# EAGLE design ESP_ILI9341_V3 (EAGLE 9.5.0)
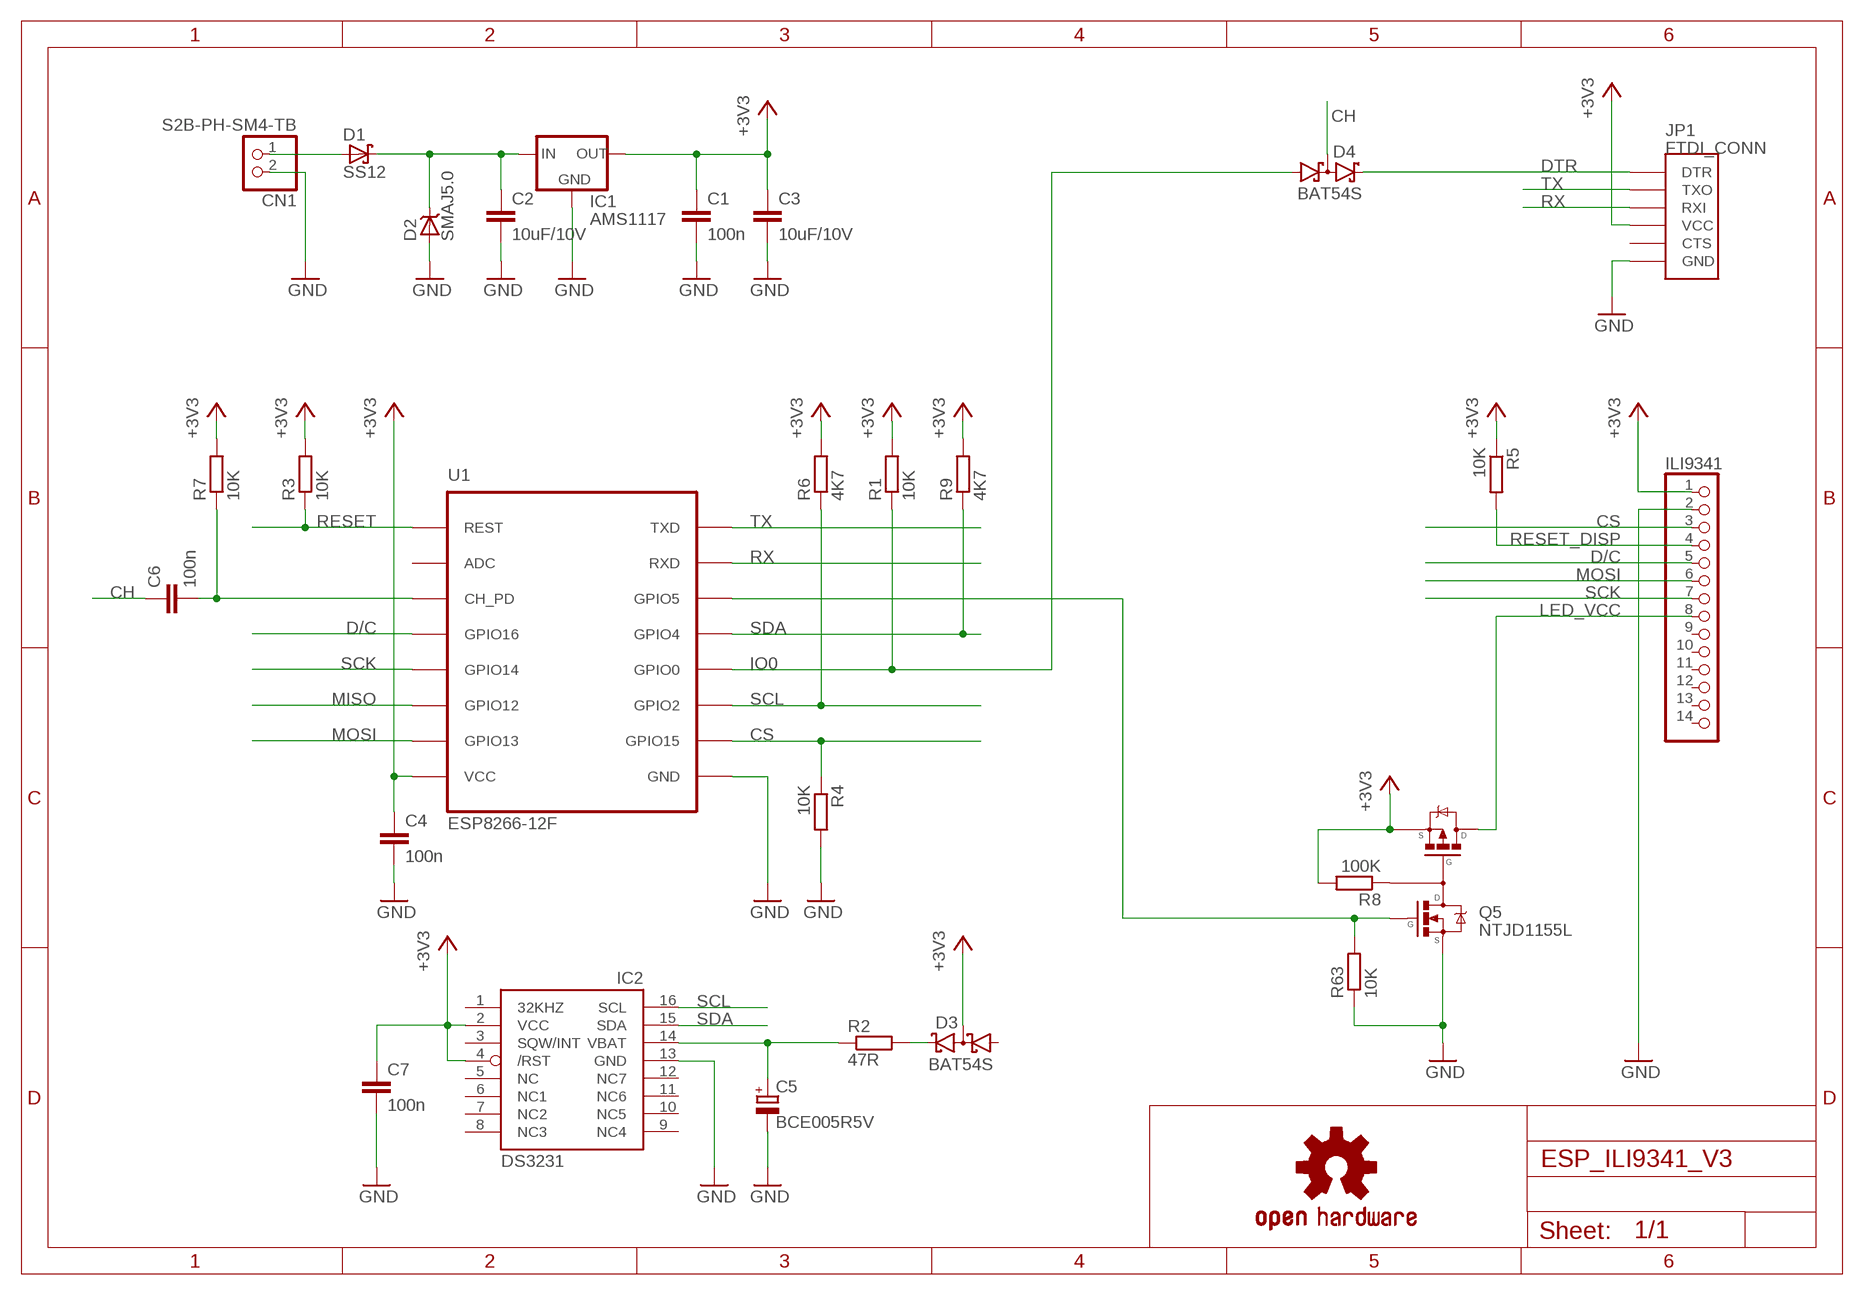
[diagram p0: schematic, sheet 1]

## Parts
C1  100n  C-EUC0805  [C0805]
C2  10uF/10V  C-EUC0805  [C0805]
C3  10uF/10V  C-EUC0805  [C0805]
C4  100n  C-EUC0805  [C0805]
C5  BCE005R5V  [BCE]
C6  100n  C-EUC0805  [C0805]
C7  100n  C-EUC0805  [C0805]
CN1  S2B-PH-SM4-TB  JST_2PIN-SMT-RA  [JST-PH-2-SMT-RA]
D1  SS12  [DO214AC]
D2  SMAJ5.0  [DO214AC]
D3  BAT54S  [SOT23]
D4  BAT54S  [SOT23]
IC1  AMS1117  LM1117-3.3  [SOT223]
IC2  DS3231/SO  [SO16W]
ILI9341  PINHD-1X14  [1X14]
JP1  FTDI_CONN  [FTDI]
LOGO1  OSHW-LOGOM-COPPER  [OSHW-LOGO-M_COPPER]
Q5  NTJD1155L  [SOT363]
R1  10K  R-EU_R0805  [R0805]
R2  47R  R-EU_R1206  [R1206]
R3  10K  R-EU_R0805  [R0805]
R4  10K  R-EU_R0805  [R0805]
R5  10K  R-EU_R0805  [R0805]
R6  4K7  R-EU_R0805  [R0805]
R7  10K  R-EU_R0805  [R0805]
R8  100K  R-EU_R0805  [R0805]
R9  4K7  R-EU_R0805  [R0805]
R63  10K  R-EU_R0805  [R0805]
U1  ESP8266-12F  ESP8266-12S  [ESP-12]

## Nets
+3V3: C1.1 C3.1 C4.1 C7.1 D3.3(C1A2) IC1.2(OUT) IC1.4(OUT) IC2.2(VCC) IC2.4(/RST) ILI9341.1 JP1.P$4(VCC) Q5.4(S2) R1.2 R3.2 R5.1 R6.2 R7.2 R8.2 R9.2 U1.VCC
CH: C6.1 D4.3(C1A2)
CS: ILI9341.3 R4.1 U1.GPIO15
D/C: ILI9341.5 U1.GPIO16
DTR: D4.2(C2) JP1.P$1(DTR)
GND: C1.2 C2.2 C3.2 C4.2 C5.- C7.2 CN1.2 D2.A IC1.1(GND) IC2.13(GND) ILI9341.2 JP1.P$6(GND) Q5.1(S1) R4.2 R63.1 U1.GND
IO0: D4.1(A1) R1.1 U1.GPIO0
LED_VCC: ILI9341.8 Q5.2(D2) Q5.3(D2)
MISO: U1.GPIO12
MOSI: ILI9341.6 U1.GPIO13
N$1: D3.2(C2) R2.2
N$2: CN1.1 D1.A
N$3: C2.1 D1.C D2.C IC1.3(IN)
N$4: C6.2 R7.1 U1.CH_PD
N$6: C5.+ IC2.14(VBAT) R2.1
N$7: Q5.6(D1/G2) R8.1
N$8: Q5.5(G1) R63.2 U1.GPIO5
RESET: R3.1 U1.REST
RESET_DISP: ILI9341.4 R5.2
RX: JP1.P$3(RXI) U1.RXD
SCK: ILI9341.7 U1.GPIO14
SCL: IC2.16(SCL) R6.1 U1.GPIO2
SDA: IC2.15(SDA) R9.1 U1.GPIO4
TX: JP1.P$2(TXO) U1.TXD
Unconnected: D3.1(A1) IC2.1(32KHZ) IC2.3(SQW/INT) IC2.5(NC) IC2.6(NC1) IC2.7(NC2) IC2.8(NC3) IC2.9(NC4) IC2.10(NC5) IC2.11(NC6) IC2.12(NC7) ILI9341.9 ILI9341.10 ILI9341.11 ILI9341.12 ILI9341.13 ILI9341.14 JP1.P$5(CTS) U1.ADC

## Library data of the parts
C1-C4 C6 C7 = rcl:C-EU: CAPACITOR, European symbol
C5 = my-super-capacitor:BCE*?: Backup super-capacitor
CN1 = adafruit:JST_2PIN: JST 2-Pin Connectors of various flavors SMT-RA (S2B-PH-SM4) 4UConnector #17311 SMT (B2B-PH-SM4) THM-RA (S2B-PH) THM (B2B-PH)
D1 = my-diode:SS?*: Schottky Barrier Rectifier; A: 1; V: 20
D2 = my-diode:SM?J*: Transient Voltage Suppression Diode - TVS
D3 D4 = diode:BAT54S: Schottky Diodes Pin connection corrected 2011-05-04 Source: Fairchild .. BAT54.pdf
IC1 = my-power:LM1117-*: LDO regulator
IC2 = adafruit:DS3231
ILI9341 = pinhead:PINHD-1X14: PIN HEADER
JP1 = my-connectors:FTDI_CONN: Connector which mates to FTDI basic or FTDI cable.
LOGO1 = SparkFun-Aesthetics:OSHW-LOGO: Open-Source Hardware (OSHW) Logo This logo indicates the piece of hardware it is found on incorporates a OSHW license and/or adheres to the definition of open source hardware found here: http://freedomdefined.org/OSHW
Q5 = my-mosfet:NTJD1155L: 8 V, 1.3 A, High Side Load Switch
R1 R3-R9 = rcl:R-EU_: RESISTOR, European symbol
R2 R63 = rcl:R-EU_: RESISTOR, European symbol; SPICEPREFIX: R
U1 = my-ESP8266:ESP8266

## Net classes
2 500mA: width 0.3 mm

## Board
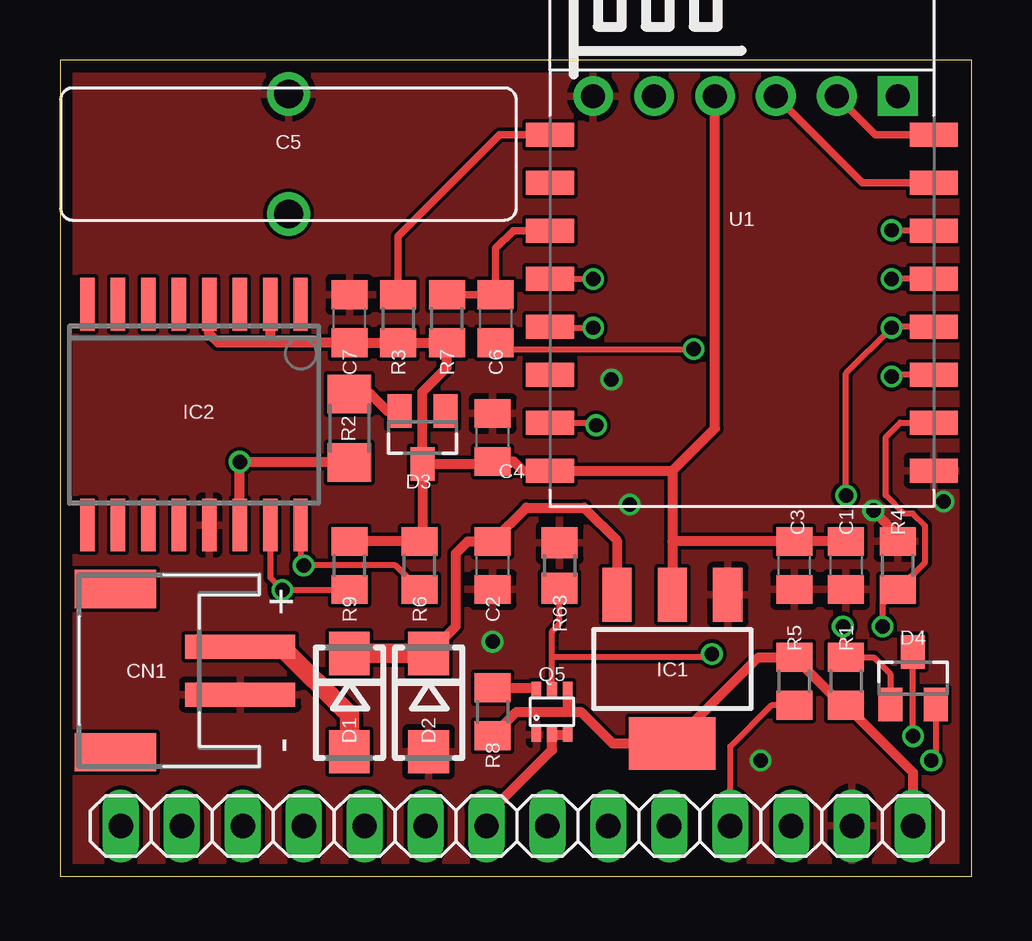
[diagram p1: board, top side]
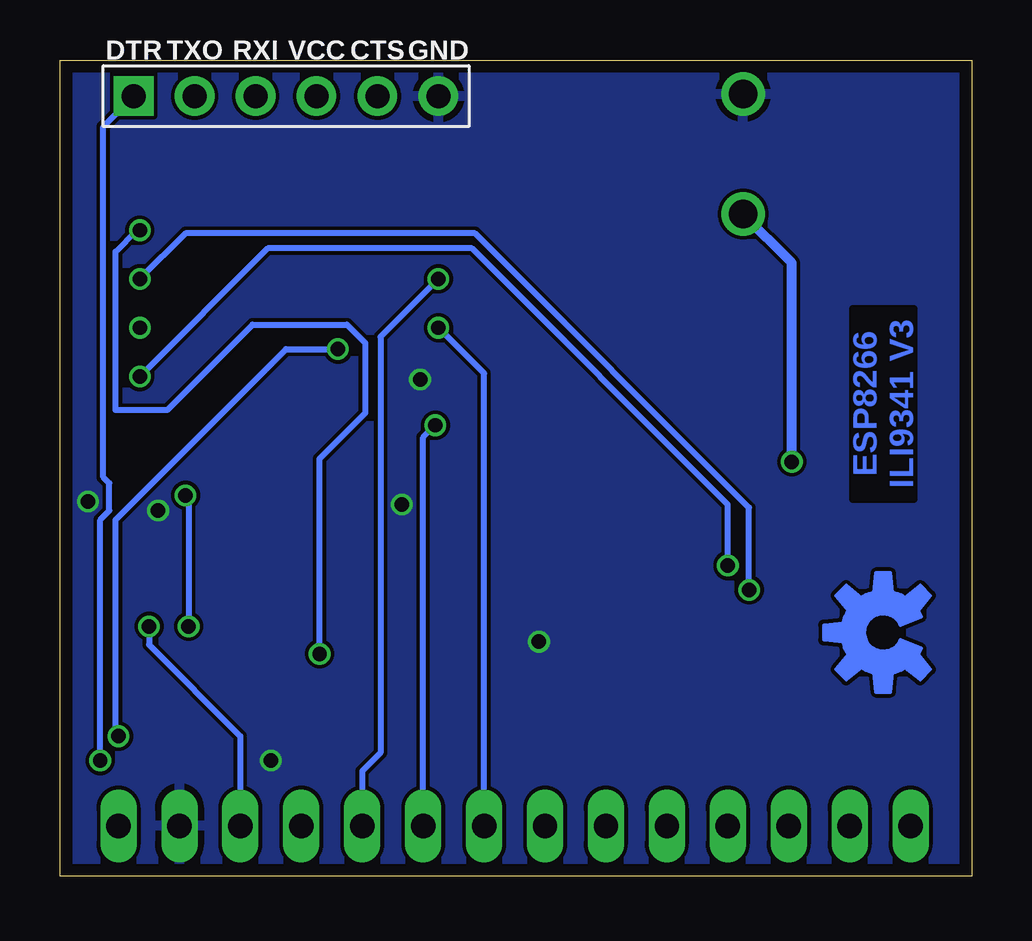
[diagram p2: board, bottom side, seen from below]

Size 38 x 34.02 mm. Coordinates in mm from the lower left corner, seen from the top.
Outline: 0,0 38,0 38,34.02 0,34.02 0,0
Copper layers (1*16): Top 0.035mm / dielectric 1.6mm / Bottom 0.035mm
Design rules "Elecrow_2-layer_PCB_eagle_rule *": minimum track width 6mil, minimum drill 12mil, track to track 6mil, track to pad 6mil, pad to pad 6mil, via to via 8mil, smd to smd 0mil, copper to edge 20mil, drill to drill 10mil, minimum pad ring 10mil, minimum via ring 6mil, stop-mask expansion 0mil, vias tented up to drill 100mil, thermal gap 10mil

### Footprints (pad centres in the part's own frame; a part is rotated, then mirrored left to right if it is on the bottom)
C0805 = smd 1.2 x 1.5: 1 -1,0; 2 1,0
BCE = drill 1.2: + -2.5,0; - 2.5,0
JST-PH-2-SMT-RA = smd 1 x 4.6: 1 1,-3.7; 2 -1,-3.7 | smd 1.6 x 3.4: NC1 -3.4,1.5; NC2 3.4,1.5
DO214AC = smd 1.8 x 1.7: A 2.05,0; C -2.05,0
SOT23 = smd 1 x 1.4: 1 -0.95,-1.1; 2 0.95,-1.1; 3 0,1.1
SOT223 = smd 1.219 x 2.235: 1 -2.311,-3.099; 2 0,-3.099; 3 2.311,-3.099 | smd 3.6 x 2.2: 4 0,3.099
SO16W = smd 0.6 x 2.2: 1 -4.445,-4.6; 2 -3.175,-4.6; 3 -1.905,-4.6; 4 -0.635,-4.6; 5 0.635,-4.6; 6 1.905,-4.6; 7 3.175,-4.6; 8 4.445,-4.6; 9 4.445,4.6; 10 3.175,4.6; 11 1.905,4.6; 12 0.635,4.6; 13 -0.635,4.6; 14 -1.905,4.6; 15 -3.175,4.6; 16 -4.445,4.6
1X14 = drill 1.016 long: 1 -16.51,0; 2 -13.97,0; 3 -11.43,0; 4 -8.89,0; 5 -6.35,0; 6 -3.81,0; 7 -1.27,0; 8 1.27,0; 9 3.81,0; 10 6.35,0; 11 8.89,0; 12 11.43,0; 13 13.97,0; 14 16.51,0
FTDI = drill 1 pad 1.651 square: P$1 -6.35,0 | drill 1 pad 1.651: P$2 -3.81,0; P$3 -1.27,0; P$4 1.27,0; P$5 3.81,0; P$6 6.35,0
SOT363 = smd 0.4 x 0.6: 1 -0.65,-0.95; 2 0,-0.95; 3 0.65,-0.95; 4 0.65,0.95; 5 0,0.95; 6 -0.65,0.95
R0805 = smd 1.2 x 1.5: 1 -1,0; 2 1,0
R1206 = smd 1.6 x 1.803: 1 -1.422,0; 2 1.422,0
R0805' = smd 1.3 x 1.5: 1 -0.95,0; 2 0.95,0
ESP-12 = smd 1 x 2: ADC -1.5,-8; CH_PD 0.5,-8; GND 10.5,8; GPIO0 4.5,8; GPIO2 6.5,8; GPIO4 2.5,8; GPIO5 0.5,8; GPIO12 6.5,-8; GPIO13 8.5,-8; GPIO14 4.5,-8; GPIO15 8.5,8; GPIO16 2.5,-8; REST -3.5,-8; RXD -1.5,8; TXD -3.5,8; VCC 10.5,-8

### Placement (x,y rotation side)
C1  32.77,12.95 270 top
C2  18.03,12.95 270 top
C3  30.61,12.95 270 top
C4  18.03,18.29 90 top
C5  9.53,30.1 90 top
C6  18.16,23.24 90 top
C7  12.06,23.24 90 top
CN1  3.81,8.57 90 top
D1  12.06,7.24 270 top
D2  15.37,7.24 270 top
D3  15.11,18.29 180 top
D4  35.56,8.26 0 top
IC1  25.53,8.64 180 top
IC2  5.59,19.24 180 top
ILI9341  19.05,2.1 180 top
JP1  28.57,32.51 0 bottom
LOGO1  3.68,10.16 90 bottom
Q5  20.51,6.86 0 top
R1  32.77,8.13 270 top
R2  12.06,18.67 90 top
R3  14.1,23.24 270 top
R4  34.92,12.95 90 top
R5  30.61,8.13 270 top
R6  14.99,12.95 90 top
R7  16.13,23.24 270 top
R8  18.03,6.86 270 top
R9  12.06,12.95 90 top
R63  10K  [R0805']  20.83,12.95 270 top
U1  28.42,27.4 270 top

### Tracks (layer width: path | path; a pad name or v marks a point on that pad's centre or on a via)
+3V3
  Top 0.406: IC2.4 6.22,22.61 6.59,22.24 8.76,22.24 | D3.3 17.93,17.19 C4.1 18.91,17.29 19.29,16.9 U1.VCC 25.53,16.9 | D3.3 15.11,20.19 16.13,21.21 R7.2 R3.2 C7.1 8.76,22.24 | IC2.2 8.76,22.24 | R9.2 R6.2 15.11,14.08 D3.3 | C1.1 C3.1 25.53,13.95 | 25.53,13.95 IC1.2 | ILI9341.1 35.56,4.33 R1.2 32.61,7.13 R5.1 29.12,9.13 IC1.4 23.04,5.54 21.72,6.86 21.16,6.86 | R8.2 19.03,6.86 21.16,6.86 | Q5.4 21.16,6.86 | 25.53,16.9 25.53,13.95 | 25.53,16.9 27.3,18.68 JP1.P$4
CH  (via drill 0.6)
  Top 0.254: C6.1 18.43,21.97 v26.42,21.97 | v35.56,5.84 D4.3
  Bottom 0.254: v26.42,21.97 28.57,21.97 35.69,14.86 35.69,5.97 v35.56,5.84
CS  (via drill 0.6)
  Top 0.254: v34.29,10.41 34.29,11.32 R4.1 36.07,13.1 36.07,14.61 35.56,15.11 35.18,15.11 34.42,15.88 34.42,18.29 35.03,18.9 U1.GPIO15
  Bottom 0.254: v34.29,10.41 34.29,9.65 30.48,5.84 ILI9341.3
D/C  (via drill 0.6)
  Top 0.254: U1.GPIO16 22.21,24.9 v22.23,24.89
  Bottom 0.254: v22.23,24.89 24.64,22.48 24.64,5.15 25.4,4.39 ILI9341.5
DTR  (via drill 0.6)
  Top 0.254: D4.2 36.51,5.01 v36.32,4.83
  Bottom 0.254: v36.32,4.83 36.32,14.86 35.94,15.24 35.94,16.38 36.2,16.64 36.2,31.24 JP1.P$1
GND  (via drill 0.6)
  Top 0.406: R4.2 34.92,14.22 v33.91,15.24
  other vias: 36.83,15.62 29.21,4.83 23.75,15.49 22.99,20.7 18.03,9.78
  pour Top: 0,0 38.1,0 38.1,34.04 0,34.04
  pour Bottom: 0,34.04 0,0 38.1,0 38.1,34.04
IO0  (via drill 0.6)
  Top 0.254: D4.1 34.61,8.44 33.92,9.13 R1.1 32.64,9.26 v32.64,10.41 | U1.GPIO0 34.71,22.9 v34.67,22.86 32.77,20.95 v32.77,15.88
  Bottom 0.254: v32.77,15.88 32.64,15.75 v32.64,10.41
LED_VCC
  Top 0.406: ILI9341.8 17.78,2.54 20.51,5.27 Q5.2 Q5.3
MOSI  (via drill 0.6)
  Top 0.254: U1.GPIO13 22.25,18.9 v22.35,18.8
  Bottom 0.254: ILI9341.6 22.86,18.29 v22.35,18.8
N$1
  Top 0.406: R2.2 12.95,20.09 13.65,19.39 D3.2
N$2
  Top 0.813: CN1.1 9.22,9.57 12.06,6.73 D1.A
N$3
  Top 0.406: 23,11.95 IC1.3 23.22,13.99 21.84,15.37 19.45,15.37 C2.1 17,13.95 16.51,13.46 16.51,10.43 D2.C
  Top 0.813: D1.C D2.C
N$4
  Top 0.305: R7.1 C6.2 18.16,26.16 18.9,26.9 U1.CH_PD
N$6  (via drill 0.6)
  Top 0.406: 7.52,17.25 v7.49,17.27 | R2.1 7.52,17.25 | 7.52,17.25 7.49,17.22 IC2.14
  Bottom 0.406: v7.49,17.27 7.49,25.57 C5.+
N$7
  Top 0.406: R8.1 19.81,7.86 Q5.6
N$8  (via drill 0.6)
  Top 0.254: Q5.5 20.51,9.14 | 20.51,9.14 20.51,10.22 20.83,10.54 R63.2 | 20.51,9.14 27.05,9.14 v27.18,9.27 | U1.GPIO5 34.69,26.9 v34.67,26.92
  Bottom 0.254: v27.18,9.27 27.18,17.4 25.27,19.3 25.27,22.23 26.04,22.99 29.97,22.99 33.53,19.43 35.69,19.43 35.69,26.04 34.8,26.92 v34.67,26.92
RESET
  Top 0.305: R3.1 14.1,26.67 18.33,30.9 U1.REST
RESET_DISP
  Top 0.254: ILI9341.4 27.94,5.4 29.67,7.13 R5.2
RX
  Top 0.305: U1.RXD 33.45,28.9 JP1.P$3
SCK  (via drill 0.6)
  Top 0.254: U1.GPIO14 20.46,22.86 v22.23,22.86
  Bottom 0.254: ILI9341.7 20.32,20.95 v22.23,22.86
SCL  (via drill 0.6)
  Top 0.254: R6.1 13.99,12.95 v10.16,12.95 10.03,13.08 IC2.16 | U1.GPIO2 34.74,20.9 v34.67,20.83
  Bottom 0.254: v10.16,12.95 10.16,15.49 20.83,26.16 29.34,26.16 v34.67,20.83
SDA  (via drill 0.6)
  Top 0.254: IC2.15 8.76,12.45 v9.27,11.94 12.05,11.94 R9.1 | U1.GPIO4 34.68,24.9 v34.67,24.89
  Bottom 0.254: v9.27,11.94 9.27,15.37 20.7,26.8 32.77,26.8 v34.67,24.89
TX
  Top 0.305: U1.TXD 33.99,30.9 JP1.P$2

### Text on the board
Bottom: ESP8266 / ILI9341 V3
bStop: ESP8266 / ILI9341 V3